# Altium schematic sheet Sensors11-20.SchDoc
size A
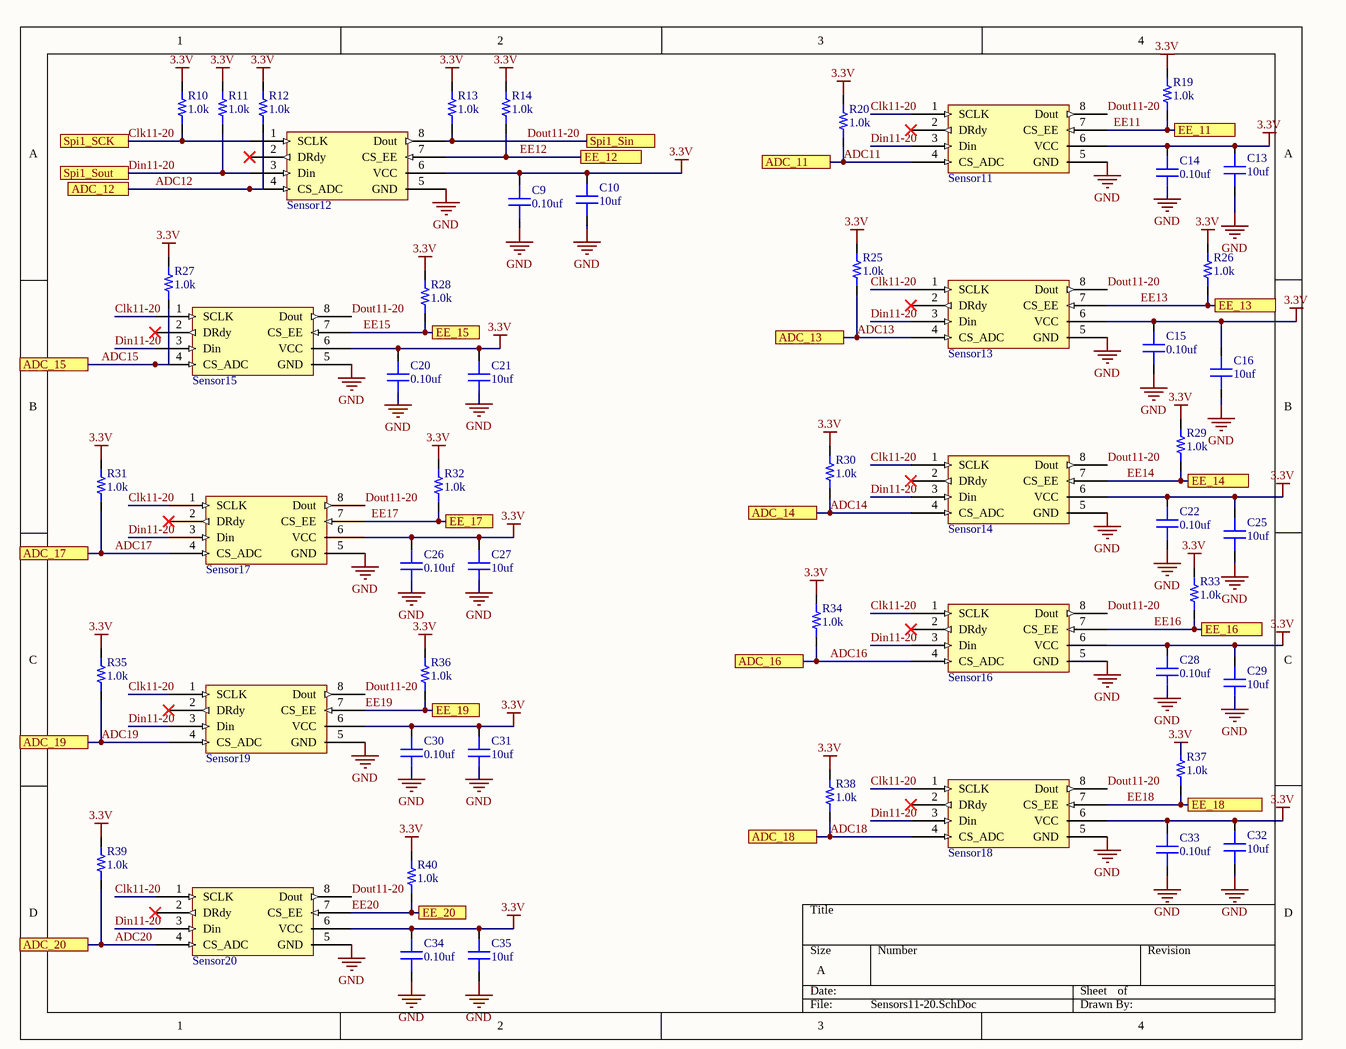
[diagram p0: Sensors11-20.SchDoc]

## Parts
C9  value 0.10uf  [CAP 0603/1608]  (hidden comment: Capacitor MLCC 0.10uf 16V CAP 0603/1608)
C10  value 10uf  [CAP 0603/1608]  (hidden comment: Capacitor MLCC 10uf 16V CAP 0603/1608)
C13  value 10uf  [CAP 0603/1608]  (hidden comment: Capacitor MLCC 10uf 16V CAP 0603/1608)
C14  value 0.10uf  [CAP 0603/1608]  (hidden comment: Capacitor MLCC 0.10uf 16V CAP 0603/1608)
C15  value 0.10uf  [CAP 0603/1608]  (hidden comment: Capacitor MLCC 0.10uf 16V CAP 0603/1608)
C16  value 10uf  [CAP 0603/1608]  (hidden comment: Capacitor MLCC 10uf 16V CAP 0603/1608)
C20  value 0.10uf  [CAP 0603/1608]  (hidden comment: Capacitor MLCC 0.10uf 16V CAP 0603/1608)
C21  value 10uf  [CAP 0603/1608]  (hidden comment: Capacitor MLCC 10uf 16V CAP 0603/1608)
C22  value 0.10uf  [CAP 0603/1608]  (hidden comment: Capacitor MLCC 0.10uf 16V CAP 0603/1608)
C25  value 10uf  [CAP 0603/1608]  (hidden comment: Capacitor MLCC 10uf 16V CAP 0603/1608)
C26  value 0.10uf  [CAP 0603/1608]  (hidden comment: Capacitor MLCC 0.10uf 16V CAP 0603/1608)
C27  value 10uf  [CAP 0603/1608]  (hidden comment: Capacitor MLCC 10uf 16V CAP 0603/1608)
C28  value 0.10uf  [CAP 0603/1608]  (hidden comment: Capacitor MLCC 0.10uf 16V CAP 0603/1608)
C29  value 10uf  [CAP 0603/1608]  (hidden comment: Capacitor MLCC 10uf 16V CAP 0603/1608)
C30  value 0.10uf  [CAP 0603/1608]  (hidden comment: Capacitor MLCC 0.10uf 16V CAP 0603/1608)
C31  value 10uf  [CAP 0603/1608]  (hidden comment: Capacitor MLCC 10uf 16V CAP 0603/1608)
C32  value 10uf  [CAP 0603/1608]  (hidden comment: Capacitor MLCC 10uf 16V CAP 0603/1608)
C33  value 0.10uf  [CAP 0603/1608]  (hidden comment: Capacitor MLCC 0.10uf 16V CAP 0603/1608)
C34  value 0.10uf  [CAP 0603/1608]  (hidden comment: Capacitor MLCC 0.10uf 16V CAP 0603/1608)
C35  value 10uf  [CAP 0603/1608]  (hidden comment: Capacitor MLCC 10uf 16V CAP 0603/1608)
R10  value 1.0k  [RES 0603/1608]  (hidden comment: Resistor 1.0k 0603 1/10W 5%)
R11  value 1.0k  [RES 0603/1608]  (hidden comment: Resistor 1.0k 0603 1/10W 5%)
R12  value 1.0k  [RES 0603/1608]  (hidden comment: Resistor 1.0k 0603 1/10W 5%)
R13  value 1.0k  [RES 0603/1608]  (hidden comment: Resistor 1.0k 0603 1/10W 5%)
R14  value 1.0k  [RES 0603/1608]  (hidden comment: Resistor 1.0k 0603 1/10W 5%)
R19  value 1.0k  [RES 0603/1608]  (hidden comment: Resistor 1.0k 0603 1/10W 5%)
R20  value 1.0k  [RES 0603/1608]  (hidden comment: Resistor 1.0k 0603 1/10W 5%)
R25  value 1.0k  [RES 0603/1608]  (hidden comment: Resistor 1.0k 0603 1/10W 5%)
R26  value 1.0k  [RES 0603/1608]  (hidden comment: Resistor 1.0k 0603 1/10W 5%)
R27  value 1.0k  [RES 0603/1608]  (hidden comment: Resistor 1.0k 0603 1/10W 5%)
R28  value 1.0k  [RES 0603/1608]  (hidden comment: Resistor 1.0k 0603 1/10W 5%)
R29  value 1.0k  [RES 0603/1608]  (hidden comment: Resistor 1.0k 0603 1/10W 5%)
R30  value 1.0k  [RES 0603/1608]  (hidden comment: Resistor 1.0k 0603 1/10W 5%)
R31  value 1.0k  [RES 0603/1608]  (hidden comment: Resistor 1.0k 0603 1/10W 5%)
R32  value 1.0k  [RES 0603/1608]  (hidden comment: Resistor 1.0k 0603 1/10W 5%)
R33  value 1.0k  [RES 0603/1608]  (hidden comment: Resistor 1.0k 0603 1/10W 5%)
R34  value 1.0k  [RES 0603/1608]  (hidden comment: Resistor 1.0k 0603 1/10W 5%)
R35  value 1.0k  [RES 0603/1608]  (hidden comment: Resistor 1.0k 0603 1/10W 5%)
R36  value 1.0k  [RES 0603/1608]  (hidden comment: Resistor 1.0k 0603 1/10W 5%)
R37  value 1.0k  [RES 0603/1608]  (hidden comment: Resistor 1.0k 0603 1/10W 5%)
R38  value 1.0k  [RES 0603/1608]  (hidden comment: Resistor 1.0k 0603 1/10W 5%)
R39  value 1.0k  [RES 0603/1608]  (hidden comment: Resistor 1.0k 0603 1/10W 5%)
R40  value 1.0k  [RES 0603/1608]  (hidden comment: Resistor 1.0k 0603 1/10W 5%)
Sensor11  for Aero Pressure Sensor Board  [RSCMJJM005NDSE3 Pressure Sensor]  (value not drawn)
Sensor12  for Aero Pressure Sensor Board  [RSCMJJM005NDSE3 Pressure Sensor]  (value not drawn)
Sensor13  for Aero Pressure Sensor Board  [RSCMJJM005NDSE3 Pressure Sensor]  (value not drawn)
Sensor14  for Aero Pressure Sensor Board  [RSCMJJM005NDSE3 Pressure Sensor]  (value not drawn)
Sensor15  for Aero Pressure Sensor Board  [RSCMJJM005NDSE3 Pressure Sensor]  (value not drawn)
Sensor16  for Aero Pressure Sensor Board  [RSCMJJM005NDSE3 Pressure Sensor]  (value not drawn)
Sensor17  for Aero Pressure Sensor Board  [RSCMJJM005NDSE3 Pressure Sensor]  (value not drawn)
Sensor18  for Aero Pressure Sensor Board  [RSCMJJM005NDSE3 Pressure Sensor]  (value not drawn)
Sensor19  for Aero Pressure Sensor Board  [RSCMJJM005NDSE3 Pressure Sensor]  (value not drawn)
Sensor20  for Aero Pressure Sensor Board  [RSCMJJM005NDSE3 Pressure Sensor]  (value not drawn)

## Ports
ADC_11, ADC_12, ADC_13, ADC_14, ADC_15, ADC_16, ADC_17, ADC_18, ADC_19, ADC_20, EE_11, EE_12, EE_13, EE_14, EE_15, EE_16, EE_17, EE_18, EE_19, EE_20, Spi1_SCK, Spi1_Sin, Spi1_Sout

## Nets
3.3V: C9.2 C10.2 C13.2 C14.2 C15.2 C16.2 C20.2 C21.2 C22.2 C25.2 C26.2 C27.2 C28.2 C29.2 C30.2 C31.2 C32.2 C33.2 C34.2 C35.2 R10.2 R11.2 R12.2 R13.2 R14.2 R19.2 R20.2 R25.2 R26.2 R27.2 R28.2 R29.2 R30.2 R31.2 R32.2 R33.2 R34.2 R35.2 R36.2 R37.2 R38.2 R39.2 R40.2 Sensor11.6(VCC) Sensor12.6(VCC) Sensor13.6(VCC) Sensor14.6(VCC) Sensor15.6(VCC) Sensor16.6(VCC) Sensor17.6(VCC) Sensor18.6(VCC) Sensor19.6(VCC) Sensor20.6(VCC)
GND: C9.1 C10.1 C13.1 C14.1 C15.1 C16.1 C20.1 C21.1 C22.1 C25.1 C26.1 C27.1 C28.1 C29.1 C30.1 C31.1 C32.1 C33.1 C34.1 C35.1 Sensor11.5(GND) Sensor12.5(GND) Sensor13.5(GND) Sensor14.5(GND) Sensor15.5(GND) Sensor16.5(GND) Sensor17.5(GND) Sensor18.5(GND) Sensor19.5(GND) Sensor20.5(GND)
ADC11: R20.1 Sensor11.4(CS_ADC) ; port ADC_11
ADC12: R12.1 Sensor12.4(CS_ADC) ; port ADC_12
ADC13: R25.1 Sensor13.4(CS_ADC) ; port ADC_13
ADC14: R30.1 Sensor14.4(CS_ADC) ; port ADC_14
ADC15: R27.1 Sensor15.4(CS_ADC) ; port ADC_15
ADC16: R34.1 Sensor16.4(CS_ADC) ; port ADC_16
ADC17: R31.1 Sensor17.4(CS_ADC) ; port ADC_17
ADC18: R38.1 Sensor18.4(CS_ADC) ; port ADC_18
ADC19: R35.1 Sensor19.4(CS_ADC) ; port ADC_19
ADC20: R39.1 Sensor20.4(CS_ADC) ; port ADC_20
Clk11-20: R10.1 Sensor11.1(SCLK) Sensor12.1(SCLK) Sensor13.1(SCLK) Sensor14.1(SCLK) Sensor15.1(SCLK) Sensor16.1(SCLK) Sensor17.1(SCLK) Sensor18.1(SCLK) Sensor19.1(SCLK) Sensor20.1(SCLK) ; port Spi1_SCK
Din11-20: R11.1 Sensor11.3(Din) Sensor12.3(Din) Sensor13.3(Din) Sensor14.3(Din) Sensor15.3(Din) Sensor16.3(Din) Sensor17.3(Din) Sensor18.3(Din) Sensor19.3(Din) Sensor20.3(Din) ; port Spi1_Sout
Dout11-20: R13.1 Sensor11.8(Dout) Sensor12.8(Dout) Sensor13.8(Dout) Sensor14.8(Dout) Sensor15.8(Dout) Sensor16.8(Dout) Sensor17.8(Dout) Sensor18.8(Dout) Sensor19.8(Dout) Sensor20.8(Dout) ; port Spi1_Sin
EE11: R19.1 Sensor11.7(CS_EE) ; port EE_11
EE12: R14.1 Sensor12.7(CS_EE) ; port EE_12
EE13: R26.1 Sensor13.7(CS_EE) ; port EE_13
EE14: R29.1 Sensor14.7(CS_EE) ; port EE_14
EE15: R28.1 Sensor15.7(CS_EE) ; port EE_15
EE16: R33.1 Sensor16.7(CS_EE) ; port EE_16
EE17: R32.1 Sensor17.7(CS_EE) ; port EE_17
EE18: R37.1 Sensor18.7(CS_EE) ; port EE_18
EE19: R36.1 Sensor19.7(CS_EE) ; port EE_19
EE20: R40.1 Sensor20.7(CS_EE) ; port EE_20

Not connected (* = marked no-connect by the designer): Sensor11 2(DRdy)*; Sensor12 2(DRdy)*; Sensor13 2(DRdy)*; Sensor14 2(DRdy)*; Sensor15 2(DRdy)*; Sensor16 2(DRdy)*; Sensor17 2(DRdy)*; Sensor18 2(DRdy)*; Sensor19 2(DRdy)*; Sensor20 2(DRdy)*

## Library data of the parts
C9 C14 C15 C20 C22 C26 C28 C30 C33 C34 = 223: Manufacturer_id: 1; idCapacitor: 223; Name: Cap_0.10uf_16V_CAP 0603/1608; Dielectric: Ceramic; Created_By: Nick Mah; Drawer_id: 1; Voltage_Rating: 16V; Package: CAP 0603/1608; Created_Date: 10/20/2018
C10 C13 C16 C21 C25 C27 C29 C31 C32 C35 = 235: Manufacturer_id: 1; idCapacitor: 235; Name: Cap_10uf_16V_CAP 0603/1608; Dielectric: Ceramic; Created_By: Nick Mah; Drawer_id: 1; Voltage_Rating: 16V; Package: CAP 0603/1608; Created_Date: 10/20/2018
R10-R14 R19 R20 R25-R40 = 1369: Manufacturer_id: 1; idResistor: 1369; Name: Res_1.0k_0603_1/10W_5%; Created_By: Nick Mah; Supplier 1: Digi-Key; Drawer_id: 1; Tolerance: 5%; Power: 1/10W; Package: 0603; ComponentLink1Description: Datasheet; Created_Date: 2018-10-20
Sensor11-Sensor20 = 27: RSCMJJM005NDSE3 Pressure Sensor; Manufacturer_id: 1; idIC_Misc: 27; Vin(Min): 2.7; Vin(Max): 3.3; Drawer_id: 1; Name: RSCMJJM005NDSE3 Pressure Sensor; Link: https://sensing.honeywell.com/RSCMJJM005NDSE3-amplified-board-mount-pressure-sensors